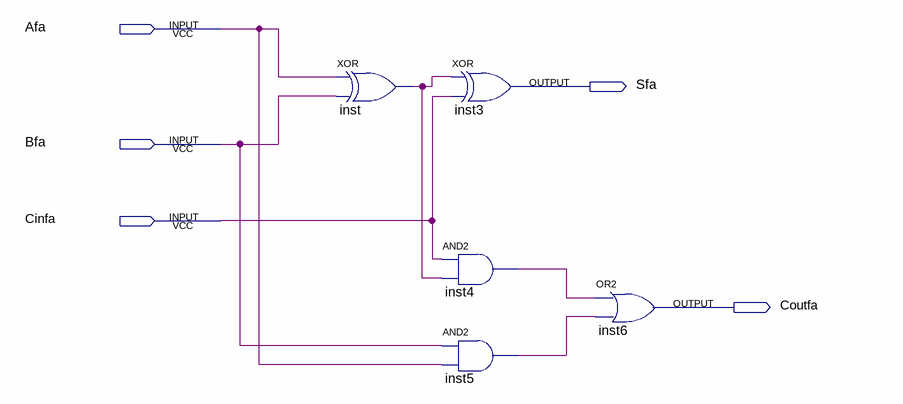
[diagram p0: schematic sheet]
// Quartus schematic FullAdder.bdf as structural Verilog: 5 symbols, 5 pins
module FullAdder (
  input  Afa,
  input  Bfa,
  input  Cinfa,
  output Sfa,
  output Coutfa
);

  wire inst4_out, inst5_out, inst_out;

  xor inst (inst_out, Afa, Bfa);
  xor inst3 (Sfa, inst_out, Cinfa);
  and inst4 (inst4_out, Cinfa, inst_out);
  and inst5 (inst5_out, Bfa, Afa);
  or inst6 (Coutfa, inst4_out, inst5_out);
endmodule
